# EAGLE board EK-TM4C1294XL REV D (EAGLE 6.5.0), part 1 of 2
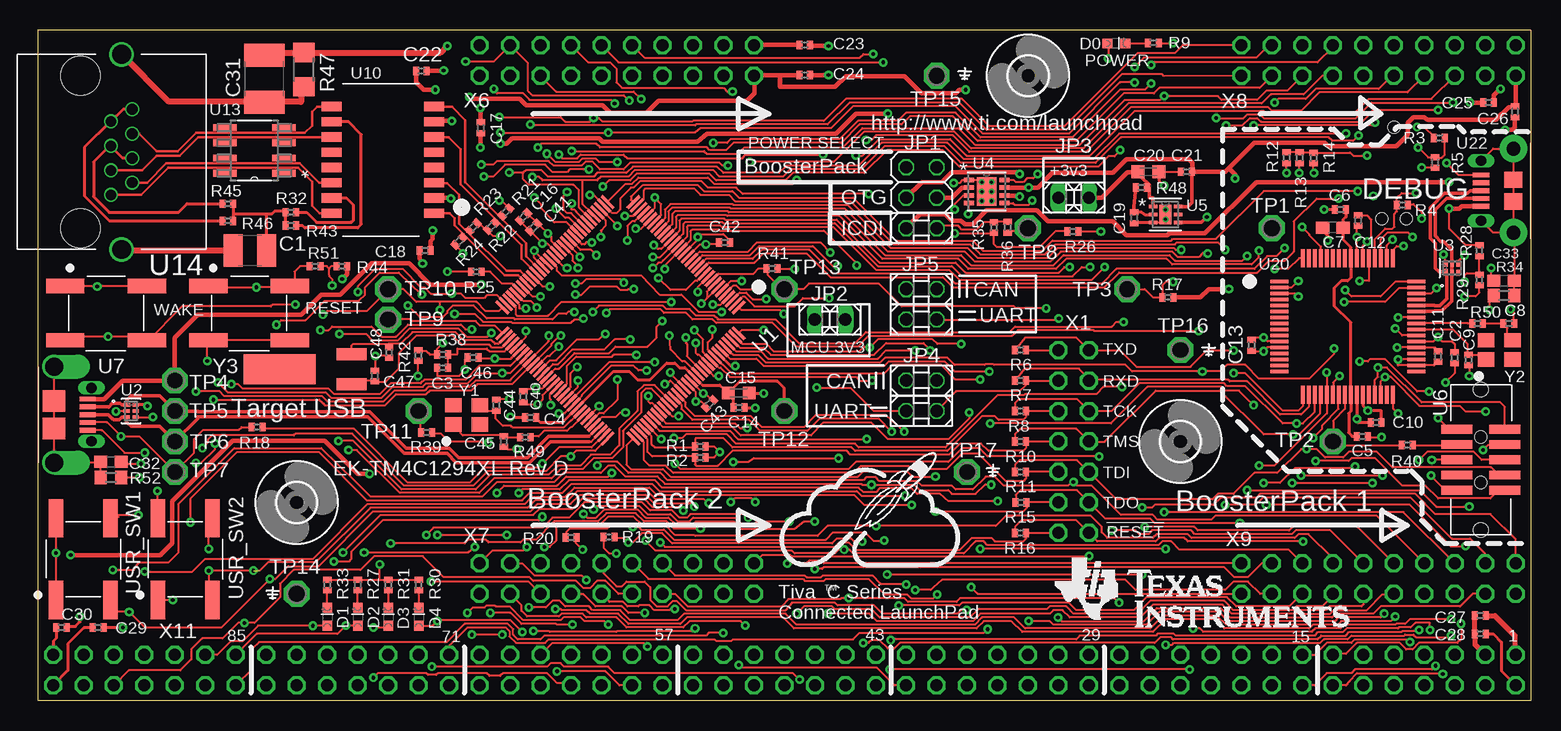
[diagram p6: board, top side]
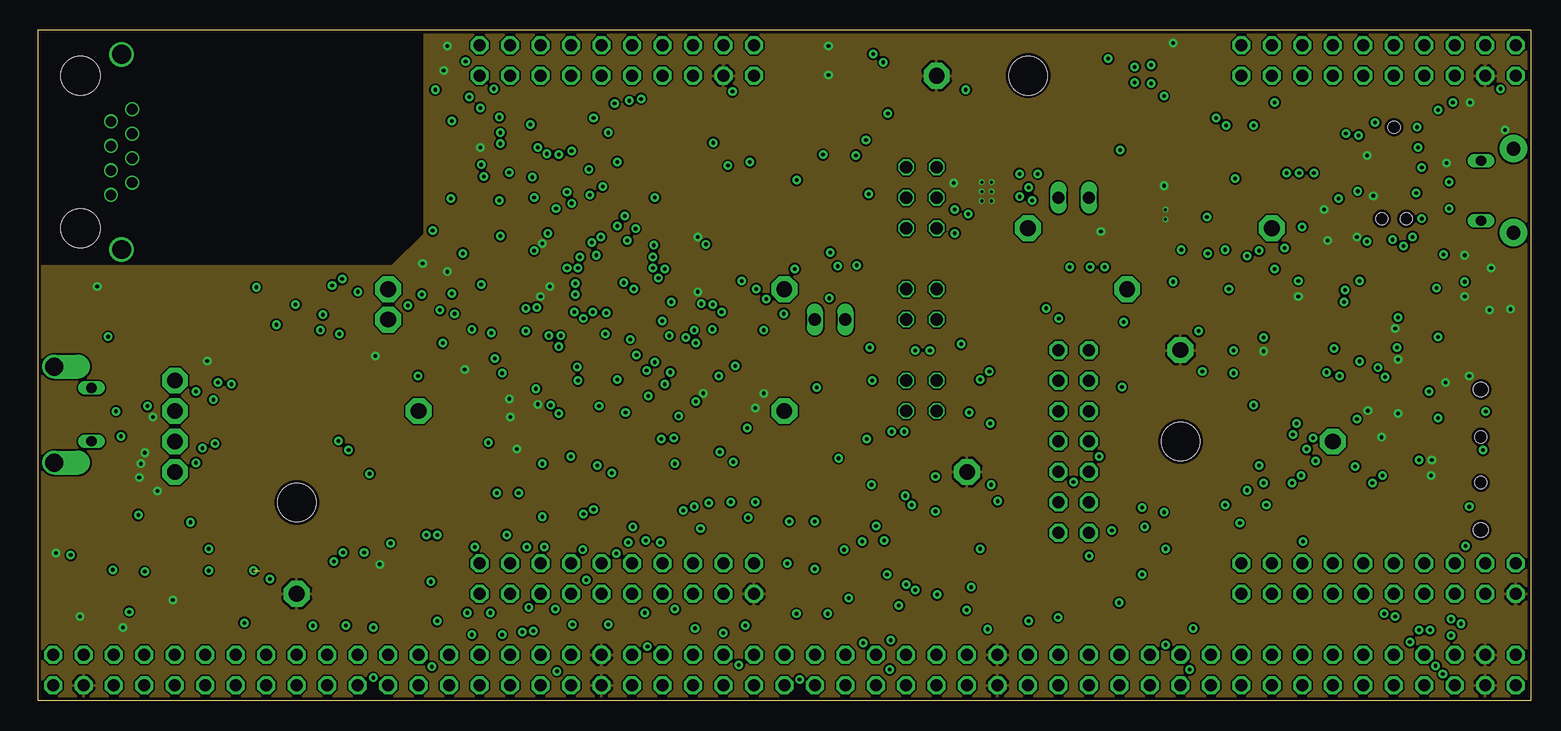
[diagram p7: board, inner layer Route2]
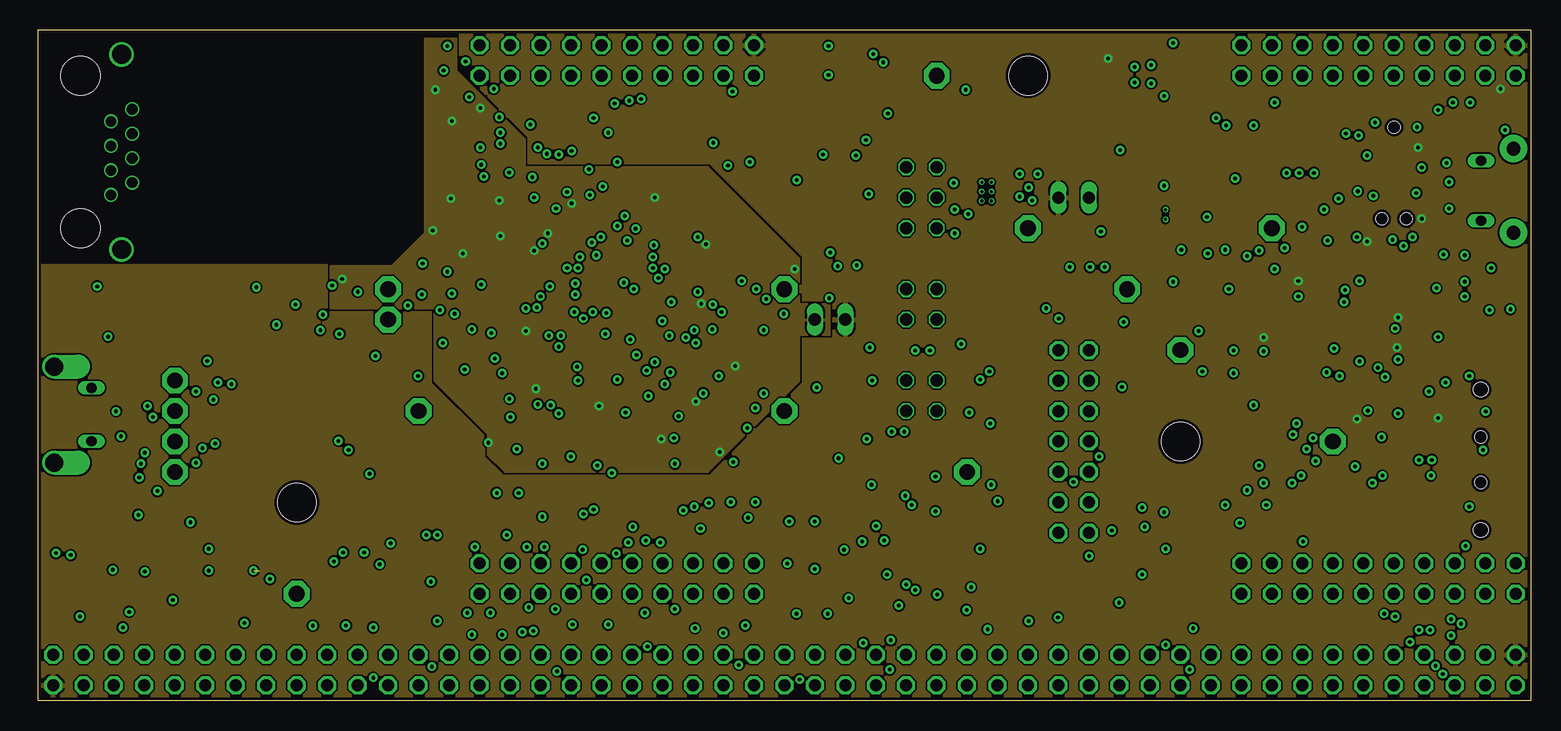
[diagram p8: board, inner layer Route15]
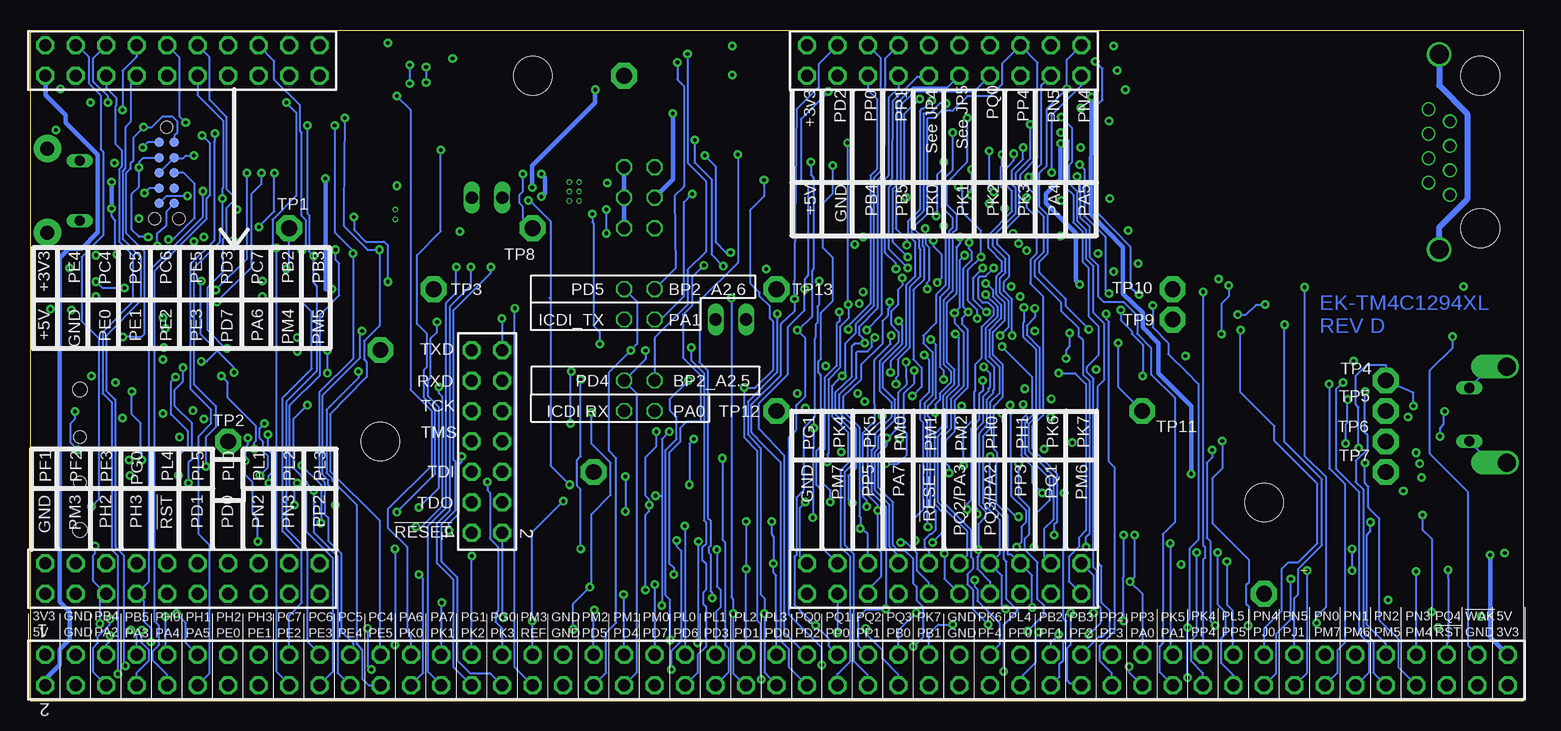
[diagram p9: board, bottom side, seen from below]

Size 124.46 x 55.88 mm. Coordinates in mm from the lower left corner, seen from the top.
Outline: 124.46,55.88 124.46,0 0,0 0,55.88 124.46,55.88
Copper layers (1+2*15+16): Top 0.035mm / dielectric 0.22mm / Route2 0.035mm / dielectric 1mm / Route15 0.035mm / dielectric 0.22mm / Bottom 0.035mm
Design rules "default *": minimum track width 6mil, minimum drill 12mil, track to track 6mil, track to pad 6mil, pad to pad 5mil, via to via 6mil, smd to smd 5mil, copper to edge 10mil, drill to drill 8mil, minimum pad ring 4mil, minimum via ring 8mil, stop-mask expansion 2mil, vias tented up to drill 13mil, thermal gap 8mil
Net classes: 1 USB: width 0.275 mm, clearance 0.152 mm; 2 Ethernet: width 0.22 mm, clearance 0.152 mm

## Footprints (pad centres in the part's own frame; a part is rotated, then mirrored left to right if it is on the bottom)
C1210 = smd 1.6 x 2.7: 1 -1.4,0; 2 1.4,0
C0402 = smd 0.5 x 0.7: 1 -0.45,0; 2 0.45,0
C0603 = smd 1.1 x 1: 1 -0.85,0; 2 0.85,0
C0603K = smd 1.05 x 1.08: 1 -0.875,0; 2 0.875,0
C1812 = smd 1.9 x 3.4: 1 -1.95,0; 2 1.95,0
CHIPLED_0603 = smd 0.8 x 0.8: A 0,-0.75; C 0,0.75
3,2 = hole 3.2: 0,0
2X03 = drill 1.016 octagon: 1 -2.54,-1.27; 2 -2.54,1.27; 3 0,-1.27; 4 0,1.27; 5 2.54,-1.27; 6 2.54,1.27
1X02 = drill 1.016 long: 1 -1.27,0; 2 1.27,0
2X02 = drill 1.016 octagon: 1 -1.27,-1.27; 2 -1.27,1.27; 3 1.27,-1.27; 4 1.27,1.27
R0402 = smd 0.5 x 0.7: 1 -0.45,0; 2 0.45,0
R0603 = smd 1 x 1.1: 1 -0.85,0; 2 0.85,0
R1206 = smd 1.6 x 1.803: 1 -1.422,0; 2 1.422,0
SWITCH_6MM_6MM_TE_CON_SMD = smd 1.2 x 3.2: P$1 4.521,6.807; P$2 4.521,0; P$3 0,6.807; P$4 0,0
P1-13 = drill 1.321 pad 2.159 octagon: TP 0,0
TQFP-128 = smd 1.45 x 0.25: P$1 0,0; P$2 0,-0.4; P$3 0,-0.8; P$4 0,-1.2; P$5 0,-1.6; P$6 0,-2; P$7 0,-2.4; P$8 0,-2.8; P$9 0,-3.2; P$10 0,-3.6; P$11 0,-4; P$12 0,-4.4; P$13 0,-4.8; P$14 0,-5.2; P$15 0,-5.6; P$16 0,-6; P$17 0,-6.4; P$18 0,-6.8; P$19 0,-7.2; P$20 0,-7.6; P$21 0,-8; P$22 0,-8.4; P$23 0,-8.8; P$24 0,-9.2; P$25 0,-9.6; P$26 0,-10; P$27 0,-10.4; P$28 0,-10.8; P$29 0,-11.2; P$30 0,-11.6; P$31 0,-12; P$32 0,-12.4; P$65 15.45,-12.4; P$66 15.45,-12; P$67 15.45,-11.6; P$68 15.45,-11.2; P$69 15.45,-10.8; P$70 15.45,-10.4; P$71 15.45,-10; P$72 15.45,-9.6; P$73 15.45,-9.2; P$74 15.45,-8.8; P$75 15.45,-8.4; P$76 15.45,-8; P$77 15.45,-7.6; P$78 15.45,-7.2; P$79 15.45,-6.8; P$80 15.45,-6.4; P$81 15.45,-6; P$82 15.45,-5.6; P$83 15.45,-5.2; P$84 15.45,-4.8; P$85 15.45,-4.4; P$86 15.45,-4; P$87 15.45,-3.6; P$88 15.45,-3.2; P$89 15.45,-2.8; P$90 15.45,-2.4; P$91 15.45,-2; P$92 15.45,-1.6; P$93 15.45,-1.2; P$94 15.45,-0.8; P$95 15.45,-0.4; P$96 15.45,0 | smd 0.25 x 1.45: P$33 1.525,-13.925; P$34 1.925,-13.925; P$35 2.325,-13.925; P$36 2.725,-13.925; P$37 3.125,-13.925; P$38 3.525,-13.925; P$39 3.925,-13.925; P$40 4.325,-13.925; P$41 4.725,-13.925; P$42 5.125,-13.925; P$43 5.525,-13.925; P$44 5.925,-13.925; P$45 6.325,-13.925; P$46 6.725,-13.925; P$47 7.125,-13.925; P$48 7.525,-13.925; P$49 7.925,-13.925; P$50 8.325,-13.925; P$51 8.725,-13.925; P$52 9.125,-13.925; P$53 9.525,-13.925; P$54 9.925,-13.925; P$55 10.325,-13.925; P$56 10.725,-13.925; P$57 11.125,-13.925; P$58 11.525,-13.925; P$59 11.925,-13.925; P$60 12.325,-13.925; P$61 12.725,-13.925; P$62 13.125,-13.925; P$63 13.525,-13.925; P$64 13.925,-13.925; P$97 13.925,1.525; P$98 13.525,1.525; P$99 13.125,1.525; P$100 12.725,1.525; P$101 12.325,1.525; P$102 11.925,1.525; P$103 11.525,1.525; P$104 11.125,1.525; P$105 10.725,1.525; P$106 10.325,1.525; P$107 9.925,1.525; P$108 9.525,1.525; P$109 9.125,1.525; P$110 8.725,1.525; P$111 8.325,1.525; P$112 7.925,1.525; P$113 7.525,1.525; P$114 7.125,1.525; P$115 6.725,1.525; P$116 6.325,1.525; P$117 5.925,1.525; P$118 5.525,1.525; P$119 5.125,1.525; P$120 4.725,1.525; P$121 4.325,1.525; P$122 3.925,1.525; P$123 3.525,1.525; P$124 3.125,1.525; P$125 2.725,1.525; P$126 2.325,1.525; P$127 1.925,1.525; P$128 1.525,1.525
DRY6 = smd 0.559 x 0.305: 1 -0.356,0.508 | smd 0.508 x 0.305: 2 -0.381,0; 3 -0.381,-0.508; 4 0.381,-0.508; 5 0.381,0; 6 0.381,0.508
DRB8_2P4X1P65 = smd 0.838 x 0.356: 1 -1.473,0.965; 2 -1.473,0.33; 3 -1.473,-0.33; 4 -1.473,-0.965; 5 1.473,-0.965; 6 1.473,-0.33; 7 1.473,0.33; 8 1.473,0.965 | smd 1.651 x 2.388: 9 0,0 | drill 0.254: V 0.406,0.787; V_2 -0.406,0; V_3 -0.406,-0.787; V_4 -0.406,0.787; V_5 0.406,-0.787; V_6 0.406,0
DRV6_1P6X1 = smd 0.711 x 0.305: 1 -1.041,0.66; 2 -1.041,0; 3 -1.041,-0.66; 4 1.041,-0.66; 5 1.041,0; 6 1.041,0.66 | smd 1.016 x 1.6: 7 0,0 | drill 0.254: V 0,-0.406; V_2 0,0.406
CON_2X5_50MIL = smd 0.74 x 2.6: P1 0,0; P2 0,4.008; P3 1.27,0; P4 1.27,4.008; P5 2.54,0; P6 2.54,4.008; P7 3.81,0; P8 3.81,4.008; P9 5.08,0; P10 5.08,4.008 | hole 1: 4.44,2; 0.64,2 | hole 1.2: 8.407,2; -3.327,2
CON_USB_MICRO_AB_HIROSE_ZX62D-AB-5P8 = smd 1.35 x 0.4: P1 2.8,1.3; P2 2.8,0.65; P3 2.8,0; P4 2.8,-0.65; P5 2.8,-1.3 | smd 1.9 x 1.8: P$1 0,-1.15; P$2 0,1.15 | drill 0.85 pad 1.092 long: P$3 3.125,2.225; P$4 3.125,-2.225 | drill 1.5 pad 2 offset: P$5 0,-4; P$6 0,4
MAG_PULSE_HX1188FNL = smd 0.76 x 1.67: P$1 0,0; P$2 1.27,0; P$3 2.54,0; P$4 3.81,0; P$5 5.08,0; P$6 6.35,0; P$7 7.62,0; P$8 8.89,0; P$9 8.89,8.55; P$10 7.62,8.55; P$11 6.35,8.55; P$12 5.08,8.55; P$13 3.81,8.55; P$14 2.54,8.55; P$15 1.27,8.55; P$16 0,8.55
D8 = smd 1.981 x 0.559: 1 -2.464,1.905; 2 -2.464,0.635; 3 -2.464,-0.635; 4 -2.464,-1.905; 5 2.464,-1.905; 6 2.464,-0.635; 7 2.464,0.635; 8 2.464,1.905
RJ45_TE_CON_NOMAG_NOLED = drill 0.89: 1 9.93,2.54; 2 8.91,4.32; 3 7.89,2.54; 4 6.87,4.32; 5 5.85,2.54; 6 4.83,4.32; 7 3.81,2.54; 8 2.79,4.32 | drill 1.57: 9 -1.78,3.43; 10 14.48,3.43 | hole 3.25: 0,0; 12.7,0
LQFP-64-PM = smd 1.5 x 0.3: P$1 0,0; P$2 0,-0.5; P$3 0,-1; P$4 0,-1.5; P$5 0,-2; P$6 0,-2.5; P$7 0,-3; P$8 0,-3.5; P$9 0,-4; P$10 0,-4.5; P$11 0,-5; P$12 0,-5.5; P$13 0,-6; P$14 0,-6.5; P$15 0,-7; P$16 0,-7.5; P$33 11.4,-7.5; P$34 11.4,-7; P$35 11.4,-6.5; P$36 11.4,-6; P$37 11.4,-5.5; P$38 11.4,-5; P$39 11.4,-4.5; P$40 11.4,-4; P$41 11.4,-3.5; P$42 11.4,-3; P$43 11.4,-2.5; P$44 11.4,-2; P$45 11.4,-1.5; P$46 11.4,-1; P$47 11.4,-0.5; P$48 11.4,0 | smd 0.3 x 1.5: P$17 1.95,-9.45; P$18 2.45,-9.45; P$19 2.95,-9.45; P$20 3.45,-9.45; P$21 3.95,-9.45; P$22 4.45,-9.45; P$23 4.95,-9.45; P$24 5.45,-9.45; P$25 5.95,-9.45; P$26 6.45,-9.45; P$27 6.95,-9.45; P$28 7.45,-9.45; P$29 7.95,-9.45; P$30 8.45,-9.45; P$31 8.95,-9.45; P$32 9.45,-9.45; P$49 9.45,1.95; P$50 8.95,1.95; P$51 8.45,1.95; P$52 7.95,1.95; P$53 7.45,1.95; P$54 6.95,1.95; P$55 6.45,1.95; P$56 5.95,1.95; P$57 5.45,1.95; P$58 4.95,1.95; P$59 4.45,1.95; P$60 3.95,1.95; P$61 3.45,1.95; P$62 2.95,1.95; P$63 2.45,1.95; P$64 1.95,1.95
TC2030-MCP-NL = smd 0.787 x 0.787: 1 1.27,-0.635; 2 2.54,-0.635; 3 3.81,-0.635; 4 5.08,-0.635; 5 6.35,-0.635; 6 6.35,0.635; 7 5.08,0.635; 8 3.81,0.635; 9 2.54,0.635; 10 1.27,0.635 | hole 1: 0,0; 7.62,-1.016; 7.62,1.016
CON_USB_MICRO_B_FCI_10118194 = smd 1.35 x 0.4: P1 2.7,1.3; P2 2.7,0.65; P3 2.7,0; P4 2.7,-0.65; P5 2.7,-1.3 | smd 1.5 x 1.35: P6 0,0.9; P7 0,-0.9 | drill 0.85 long: P8 2.7,2.5; P9 2.7,-2.5 | drill 1.15 pad 2.286: P10 0,-3.5; P11 0,3.5
TSW-107-02-S-D = drill 1 pad 1.5 octagon: 1 7.62,-1.27; 2 7.62,1.27; 3 5.08,-1.27; 4 5.08,1.27; 5 2.54,-1.27; 6 2.54,1.27; 7 0,-1.27; 8 0,1.27; 9 -2.54,-1.27; 10 -2.54,1.27; 11 -5.08,-1.27; 12 -5.08,1.27; 13 -7.62,-1.27; 14 -7.62,1.27
TSW-110-02-S-D = drill 1 pad 1.5 octagon: 1 11.43,-1.27; 2 11.43,1.27; 3 8.89,-1.27; 4 8.89,1.27; 5 6.35,-1.27; 6 6.35,1.27; 7 3.81,-1.27; 8 3.81,1.27; 9 1.27,-1.27; 10 1.27,1.27; 11 -1.27,-1.27; 12 -1.27,1.27; 13 -3.81,-1.27; 14 -3.81,1.27; 15 -6.35,-1.27; 16 -6.35,1.27; 17 -8.89,-1.27; 18 -8.89,1.27; 19 -11.43,-1.27; 20 -11.43,1.27
TSW-149-02-S-D = drill 1 pad 1.5 octagon: 1 60.96,-1.27; 2 60.96,1.27; 3 58.42,-1.27; 4 58.42,1.27; 5 55.88,-1.27; 6 55.88,1.27; 7 53.34,-1.27; 8 53.34,1.27; 9 50.8,-1.27; 10 50.8,1.27; 11 48.26,-1.27; 12 48.26,1.27; 13 45.72,-1.27; 14 45.72,1.27; 15 43.18,-1.27; 16 43.18,1.27; 17 40.64,-1.27; 18 40.64,1.27; 19 38.1,-1.27; 20 38.1,1.27; 21 35.56,-1.27; 22 35.56,1.27; 23 33.02,-1.27; 24 33.02,1.27; 25 30.48,-1.27; 26 30.48,1.27; 27 27.94,-1.27; 28 27.94,1.27; 29 25.4,-1.27; 30 25.4,1.27; 31 22.86,-1.27; 32 22.86,1.27; 33 20.32,-1.27; 34 20.32,1.27; 35 17.78,-1.27; 36 17.78,1.27; 37 15.24,-1.27; 38 15.24,1.27; 39 12.7,-1.27; 40 12.7,1.27; 41 10.16,-1.27; 42 10.16,1.27; 43 7.62,-1.27; 44 7.62,1.27; 45 5.08,-1.27; 46 5.08,1.27; 47 2.54,-1.27; 48 2.54,1.27; 49 0,-1.27; 50 0,1.27; 51 -2.54,-1.27; 52 -2.54,1.27; 53 -5.08,-1.27; 54 -5.08,1.27; 55 -7.62,-1.27; 56 -7.62,1.27; 57 -10.16,-1.27; 58 -10.16,1.27; 59 -12.7,-1.27; 60 -12.7,1.27; 61 -15.24,-1.27; 62 -15.24,1.27; 63 -17.78,-1.27; 64 -17.78,1.27; 65 -20.32,-1.27; 66 -20.32,1.27; 67 -22.86,-1.27; 68 -22.86,1.27; 69 -25.4,-1.27; 70 -25.4,1.27; 71 -27.94,-1.27; 72 -27.94,1.27; 73 -30.48,-1.27; 74 -30.48,1.27; 75 -33.02,-1.27; 76 -33.02,1.27; 77 -35.56,-1.27; 78 -35.56,1.27; 79 -38.1,-1.27; 80 -38.1,1.27; 81 -40.64,-1.27; 82 -40.64,1.27; 83 -43.18,-1.27; 84 -43.18,1.27; 85 -45.72,-1.27; 86 -45.72,1.27; 87 -48.26,-1.27; 88 -48.26,1.27; 89 -50.8,-1.27; 90 -50.8,1.27; 91 -53.34,-1.27; 92 -53.34,1.27; 93 -55.88,-1.27; 94 -55.88,1.27; 95 -58.42,-1.27; 96 -58.42,1.27; 97 -60.96,-1.27; 98 -60.96,1.27
NDK3.2X2.5 = smd 1.4 x 1.2: P$1 0,0; P$2 2.2,0; P$3 2.2,1.6; P$4 0,1.6
CRYSTAL_32K_SMD = smd 2.5 x 1: P$1 0,1.25; P$2 0,-1.25 | smd 6 x 2.5: P$3 -6,0

## Placement (x,y rotation side)
C1  1000pF  [C1210]  17.68,37.49 180 top
C2  0.1uF  [C0402]  118.11,28.57 270 top
C3  0.1uF  [C0402]  33.76,27.74 180 top
C4  0.1uF  [C0402]  41.07,23.6 180 top
C5  0.1uF  [C0402]  110.41,22 0 top
C6  1.0uF  [C0402]  108.58,40.92 180 top
C7  2.2uF  [C0603]  107.95,39.42 180 top
C8  12pF  [C0402]  122.63,31.42 0 top
C9  12pF  [C0402]  119.25,28.37 270 top
C10  0.1uF  [C0402]  111.56,23.16 0 top
C11  0.1uF  [C0402]  116.71,28.68 270 top
C12  0.1uF  [C0402]  110.06,40.01 270 top
C13  0.1uF  [C0402]  101.17,29.62 270 top
C14  1.0uF  [C0402]  58.45,24.41 0 top
C15  2.2uF  [C0603K]  58.45,25.63 0 top
C16  0.1uF  [C0402]  40.49,40.31 225 top
C17  0.1uF  [C0402]  36.93,47.73 270 top
C18  0.1uF  [C0402]  32.28,37.49 180 top
C19  0.1uF  [C0402]  91.39,40.23 270 top
C20  2.2uF  [C0603K]  92.58,44.07 0 top
C21  0.1uF  [C0402]  95.76,44.07 180 top
C22  0.1uF  [C0402]  31.98,52.48 0 top
C23  0.1uF  [C0402]  63.93,54.64 0 top
C24  0.1uF  [C0402]  63.93,52.12 0 top
C25  0.1uF  [C0402]  120.93,49.83 180 top
C26  0.1uF  [C0402]  123.14,49.07 270 top
C27  0.1uF  [C0402]  120.24,7.09 180 top
C28  0.1uF  [C0402]  120.24,5.56 180 top
C29  0.1uF  [C0402]  5.03,6.1 0 top
C30  0.1uF  [C0402]  1.98,6.1 0 top
C31  4700pF  [C1812]  18.9,51.82 90 top
C32  3300pF  [C0603]  6.1,19.89 0 top
C33  3300pF  [C0603]  122.22,34.98 180 top
C40  0.1uF  [C0402]  40.46,25.32 270 top
C41  0.1uF  [C0402]  41.33,39.45 225 top
C42  0.1uF  [C0402]  57.25,38.18 0 top
C43  0.1uF  [C0402]  56.01,24.74 45 top
C44  12pF  [C0402]  38.23,24.61 90 top
C45  12pF  [C0402]  38.84,21.59 270 top
C46  0.1uF  [C0402]  36.3,28.6 180 top
C47  12pF  [C0402]  28.09,27.05 90 top
C48  12pF  [C0402]  29.29,29.01 270 top
D0  [CHIPLED_0603]  89.92,54.76 270 top
D1  [CHIPLED_0603]  24.13,6.99 0 top
D2  [CHIPLED_0603]  26.67,6.99 0 top
D3  [CHIPLED_0603]  29.21,6.99 0 top
D4  [CHIPLED_0603]  31.75,6.99 0 top
H1  MOUNT-HOLE3.2  [3,2]  95.25,21.59 0 top
H4  MOUNT-HOLE3.2  [3,2]  21.59,16.51 0 top
H6  MOUNT-HOLE3.2  [3,2]  82.55,52.07 0 top
J1  [JUMP]  73.66,39.37 90 top
J2  [JUMP]  73.66,24.13 90 top
J3  [JUMP]  86.36,41.91 90 top
J4  [JUMP]  73.66,26.67 90 top
J5  [JUMP]  73.66,31.75 90 top
J6  [JUMP]  73.66,34.29 90 top
J7  [JUMP]  66.04,31.75 90 top
JP1  [2X03]  73.66,41.91 270 top
JP2  [1X02]  66.04,31.75 180 top
JP3  [1X02]  86.36,41.91 0 top
JP4  [2X02]  73.66,25.4 90 top
JP5  [2X02]  73.66,33.02 90 top
R1  10k  [R0402]  55.22,21.18 180 top
R2  10k  [R0402]  55.22,20.24 180 top
R3  10k  [R0402]  116.84,46.89 0 top
R4  10k  [R0402]  113.74,41.3 180 top
R5  10k  [R0402]  116.48,44.83 270 top
R6  0  [R0402]  81.92,29.21 180 top
R7  0  [R0402]  81.92,26.67 180 top
R8  0  [R0402]  81.92,24.13 180 top
R9  330  [R0402]  92.99,54.81 180 top
R10  0  [R0402]  81.92,21.59 180 top
R11  0  [R0402]  81.92,19.05 180 top
R12  5.6k  [R0402]  104.09,45.24 90 top
R13  5.6k  [R0402]  105.18,45.24 90 top
R14  5.6k  [R0402]  106.35,45.21 90 top
R15  0  [R0402]  81.97,16.51 180 top
R16  0  [R0402]  81.92,13.97 180 top
R17  100k  [R0402]  94.21,33.6 180 top
R18  100  [R0402]  18.29,22.78 180 top
R19  0  [R0402]  47.62,13.61 0 top
R20  0  [R0402]  44.45,13.59 180 top
R21  49.9  [R0402]  39.01,40.72 225 top
R22  49.9  [R0402]  37.82,39.52 45 top
R23  49.4  [R0402]  36.3,39.47 225 top
R24  49.9  [R0402]  35.1,38.28 45 top
R25  4.87k 1%  [R0402]  36.55,35.74 180 top
R26  100k  [R0402]  86.28,39.09 0 top
R27  330  [R0402]  26.67,9.63 270 top
R28  5.6k  [R0402]  120.17,37.49 90 top
R29  10k  [R0402]  120.17,35.05 90 top
R30  330  [R0402]  31.75,9.63 270 top
R31  330  [R0402]  29.21,9.63 270 top
R32  75  [R0402]  21.11,40.69 0 top
R33  330  [R0402]  24.13,9.63 270 top
R34  1M  [R0603]  122.22,33.76 0 top
R35  10k  [R0402]  79.71,39.42 270 top
R36  100k  [R0402]  80.85,39.45 90 top
R38  51  [R0402]  33.76,28.83 0 top
R39  0  [R0402]  32.41,22.33 0 top
R40  0  [R0402]  114.17,21.29 0 top
R41  0  [R0402]  61.21,36.02 0 top
R42  1M  [R0402]  31.72,28.75 270 top
R43  75  [R0402]  21.11,39.57 0 top
R44  10k  [R0402]  25.35,36.2 180 top
R45  75  [R0402]  15.85,41.4 180 top
R46  75  [R0402]  15.85,39.98 180 top
R47  1M  [R1206]  22.17,52.58 270 top
R48  [R0402]  92,42.76 0 top
R49  2k  [R0402]  40.64,21.95 0 top
R50  2k  [R0402]  120.02,31.42 0 top
R51  100  [R0402]  23.13,36.2 0 top
R52  1M  [R0603]  6.1,18.59 180 top
RESET  SWITCH_TACTILE  [SWITCH_6MM_6MM_TE_CON_SMD]  14.22,34.54 270 top
TP1  TPPAD1-13  [P1-13]  102.87,39.37 270 top
TP2  TPPAD1-13  [P1-13]  107.95,21.59 0 top
TP3  TPPAD1-13  [P1-13]  90.81,34.29 180 top
TP4  TPPAD1-13  [P1-13]  11.43,26.67 90 top
TP5  TPPAD1-13  [P1-13]  11.43,24.13 270 top
TP6  TPPAD1-13  [P1-13]  11.43,21.59 90 top
TP7  TPPAD1-13  [P1-13]  11.43,19.05 270 top
TP8  TPPAD1-13  [P1-13]  82.55,39.37 180 top
TP9  TPPAD1-13  [P1-13]  29.21,31.75 0 top
TP10  TPPAD1-13  [P1-13]  29.21,34.29 0 top
TP11  TPPAD1-13  [P1-13]  31.75,24.13 0 top
TP12  TPPAD1-13  [P1-13]  62.23,24.13 0 top
TP13  TPPAD1-13  [P1-13]  62.23,34.29 0 top
TP14  TPPAD1-13  [P1-13]  21.59,8.89 0 top
TP15  TPPAD1-13  [P1-13]  74.93,52.07 0 top
TP16  TPPAD1-13  [P1-13]  95.25,29.21 0 top
TP17  TPPAD1-13  [P1-13]  77.47,19.05 0 top
U1  TM4C1294NCPDT  [TQFP-128]  58.42,32.77 225 top
U2  TPD4S012_DRY_6  [DRY6]  7.77,24.13 0 top
U3  TPD4S012_DRY_6  [DRY6]  117.88,36.04 90 top
U4  TPS2052B_DRB_8  [DRB8_2P4X1P65]  79.1,42.42 0 top
U5  TPS73733_DRV_6  [DRV6_1P6X1]  94,40.5 0 top
U6  JTAG_ARM_10PIN  [CON_2X5_50MIL]  118.29,22.61 270 top
U7  CON_USB_HIROSE_MICRO_AB_ZX62D_AB_5P8  [CON_USB_MICRO_AB_HIROSE_ZX62D-AB-5P8]  1.35,23.83 0 top
U10  MAG_PULSE_HX1188FNL  [MAG_PULSE_HX1188FNL]  33.05,40.61 90 top
U13  SLVU2.8-4  [D8]  18.06,45.85 180 top
U14  JACK_RJ45_NOMAG_NOLED_TECON  [RJ45_TE_CON_NOMAG_NOLED]  3.56,52.07 270 top
U20  TM4C123GH6PMI  [LQFP-64-PM]  103.5,34.92 0 top
U21  TC2050-NL-MCP-NL  [TC2030-MCP-NL]  113.06,47.78 270 bottom
U22  CON_USB_FCI_MICRO_B_10118194  [CON_USB_MICRO_B_FCI_10118194]  123.01,42.49 180 top
USR_SW1  SWITCH_TACTILE  [SWITCH_6MM_6MM_TE_CON_SMD]  1.52,8.38 0 top
USR_SW2  SWITCH_TACTILE  [SWITCH_6MM_6MM_TE_CON_SMD]  10.03,8.38 0 top
WAKE  SWITCH_TACTILE  [SWITCH_6MM_6MM_TE_CON_SMD]  2.29,34.54 270 top
X1  TSW-107-02-S-D  [TSW-107-02-S-D]  86.36,21.59 270 bottom
X6  TSW-110-02-S-D  [TSW-110-02-S-D]  48.26,53.34 180 bottom
X7  TSW-110-02-S-D  [TSW-110-02-S-D]  48.26,10.16 180 bottom
X8  TSW-110-02-S-D  [TSW-110-02-S-D]  111.76,53.34 180 bottom
X9  TSW-110-02-S-D  [TSW-110-02-S-D]  111.76,10.16 180 bottom
X11  TSW-149-02-S-D  [TSW-149-02-S-D]  62.23,2.54 180 bottom
Y1  25Mhz  [NDK3.2X2.5]  34.65,23.01 0 top
Y2  16M  [NDK3.2X2.5]  120.73,28.42 0 top
Y3  CRYATL_32K_SMD  [CRYSTAL_32K_SMD]  26.16,27.61 0 top

## Tracks (layer width: path | path; a pad name or v marks a point on that pad's centre or on a via)
!DEBUG_RESET_OUT  (via drill 0.3)
  Top 0.152: U20.P$23 108.43,25.45 108.43,24.31 107.06,22.94 107.06,22.63 v106.3,21.87 | R16.2 81.46,13.95 81.46,14.48 81.49,14.51 81.99,15.01 86.59,15.01 X1.1 87.61,13.97 88.32,13.26 93.19,13.26 93.5,13.56 95.56,13.56 95.86,13.26 v105.46,13.26 | U6.P10 121.77,17.53 121.08,16.84 116.74,16.84 115.67,17.91 113.77,17.91 111.48,20.19 109.5,20.19 109.27,19.96 v106.53,19.96
  Bottom 0.152: v105.46,13.26 105.46,15.16 105.92,15.62 105.92,18.21 106.53,18.82 v106.53,19.96 106.53,21.11 106.3,21.34 v106.3,21.87
!EXTERNAL_DEBUG
  Top 0.152: U20.P$24 108.95,24.3 107.97,23.32 107.97,21.61 | 107.97,21.61 TP2.TP | 107.97,21.61 108.33,21.26 113.5,21.26 R40.1
!HIB
  Top 0.152: TP9.TP 29.34,31.77 31.01,31.77 31.17,31.62 36.5,31.62 36.88,31.24 38.1,31.24 38.12,31.22 U1.P$65
!TARGET_RESET  (via drill 0.3)
  Top 0.152: RESET.P$4 15.54,34.52 15.24,34.52 15.32,34.44 v18.21,34.44 | v18.21,34.44 18.25,34.48 19.62,34.48 20.01,34.78 | 20.01,34.78 RESET.P$3 | v51.89,13.18 52.27,12.8 66.45,12.8 66.83,13.18 67.59,13.18 68.2,12.57 76.89,12.57 77.88,13.56 79.48,13.56 79.78,13.26 82.14,13.26 82.37,13.49 82.37,13.79 R16.1 X1.2 | v85.04,6.93 85.34,6.63 92.2,6.63 93.27,7.7 98.6,7.7 99.36,6.93 105.31,6.93 105.61,7.24 107.75,7.24 108.05,7.54 110.8,7.54 112.09,8.84 112.98,8.84 X9.10 | X7.10 48.41,8.89 47.32,9.98 46.63,9.98 46.02,9.37 45.49,9.37 44.88,9.98 41.3,9.98 41,10.29 33.83,10.29 32.08,12.04 28.04,12.04 26.9,10.9 21.34,10.9 20.19,9.75 20.19,8.61 18.06,6.48 v17.22,6.48 16.69,6.48 15.39,5.18 13.72,5.18 12.8,4.27 12.8,3.43 11.89,2.52 7.59,2.52 X11.94 | v18.22,34.44 v18.21,34.44 | R51.1 21.87,36.2 21.41,35.74 21.41,34.98 21.38,34.86 21.38,34.4 21.79,34.82 20.01,34.78
  Bottom 0.152: v51.89,13.18 51.44,13.18 50.52,12.27 50.52,10.82 49.53,9.83 X7.10 | X1.2 85.09,6.99 v85.04,6.93 | v18.21,34.44 18.21,20.42 16.46,18.67 16.46,7.77 17.22,7.01 v17.22,6.48
!TARGET_RESET_FILTERED  (via drill 0.3)
  Top 0.152: 39.55,28.6 | C46.1 36.88,28.5 v38.1,28.5 39.45,28.5 39.55,28.6 | R44.2 24.46,36.2 24.31,36.04 24.31,35.97 | v24.54,34.59 24.54,35.13 24.31,35.36 24.31,35.42 24.31,35.97 | v25.15,30.56 27.36,30.56 27.89,30.02 30.02,30.02 31.01,31.01 35.05,31.01 35.74,30.33 37.49,30.33 v37.8,30.63 | 24.31,35.97 24.08,36.2 23.77,36.2 23.79,36.19 R51.2 | U1.P$70 39.55,28.6
  Bottom 0.152: v24.54,34.59 24.54,33.68 25.15,33.07 v25.15,30.56 | v37.8,30.63 37.8,29.52 38.1,29.21 v38.1,28.5
!WAKE  (via drill 0.3)
  Top 0.152: WAKE.P$2 2.9,30.33 4.88,30.32 v5.87,30.32 8.38,30.32 8.84,29.79 WAKE.P$1 9.02,30.28 9.07,29.87 12.04,32.84 19.43,32.84 19.58,32.99 v21.49,32.99 | 33.53,33.22 36.58,33.22 37.34,32.46 38.42,32.46 U1.P$64 | 33.53,33.22 31.55,33.22 30.48,34.29 TP10.TP 29.21,34.24 27.43,32.46 24.08,32.46 v23.77,32.16 | v33.53,32.54 33.53,33.22 | v31.7,27.05 31.73,27.08 R42.2
  Bottom 0.152: X11.95 4.57,4.57 4.57,17.37 7.77,20.57 7.77,27.51 5.87,29.41 v5.87,30.32 | v23.77,32.16 23.09,32.16 22.25,32.99 v21.49,32.99 | v33.53,32.54 33.53,31.7 32.61,30.79 32.61,30.56 31.7,29.64 v31.7,27.05
+3V3  (via drill 0.3)
  Top 0.152: D0.A 89.23,54.76 v89.23,53.49 | U20.P$42 114.53,31.93 v113.39,31.93 | U20.P$54 110.45,37.91 v110.8,38.25 111.18,38.63 111.18,40.08 110.87,40.39 110.19,40.39 110.19,40.31 110.22,40.43 C12.1 | v115.06,46.1 115.9,45.26 116.51,45.26 R5.1 116.5,45.25 117.03,45.25 117.27,45.49 117.27,46.79 117.2,46.86 R3.2 | v115.37,40.16 115.37,40.69 114.68,41.38 114.3,41.38 114.27,41.38 R4.1 | U20.P$2 104.53,34.42 v105.08,34.98 | 116.48,29.18 C11.1 116.42,29.43 U20.P$37 113.31,29.43 v113.31,29.41 | U20.P$11 102.51,29.93 v102.18,30.25 102.17,30.27 101.51,30.27 101.35,30.1 C13.1 | U6.P1 117.68,22.61 v116.74,23.55
  Top 0.254: C29.1 4.38,6.06 3.85,6.06 2.52,4.72 2.52,2.52 X11.98 | U20.P$26 109.95,23.85 v109.96,23.47 109.96,23.24 110.03,23.16 C10.1
  Top 0.381: C23.1 59.72,54.63 X6.1 | C25.1 121.38,50.44 v121.92,50.98
  Top 0.406: C27.1 121.46,7.09 123.14,5.41 123.14,3.81 123.11,3.95 X11.1
  Bottom 0.152: U21.1 114.66,46.51 v115.06,46.1 | v105.08,34.98 105,34.9 | v113.31,29.41 113.39,29.41 | v116.74,23.55 116.74,23.47
  Bottom 0.381: v121.92,50.98 121.92,51.05
  pour Route15 (rank 2): 32.26,55.88 124.46,55.88 124.46,0 0,0 0,36.2 29.51,36.2 32.26,38.91
+5V  (via drill 0.3)
  Top 0.254: C30.1 1.53,5.19 1.29,4.95 1.29,3.96 1.22,3.89 1.33,3.87 X11.97 | X11.2 122,2.46 122,4.88 121.31,5.56 C28.1
  Top 0.305: U5.6 95.88,41.16 95.86,41.15 96.21,41.5 C21.1
  Top 0.356: U4.7 v82.6,42.75
  Top 0.381: 123.17,52.07 X8.2 123.19,49.77 C26.1 122.87,49.45 122.61,49.45 121.54,48.39 115.82,48.39 115.59,48.62 114.68,48.62 114.22,48.16 114.22,47.17 113.23,46.18 107.59,46.18 107.29,46.48 101.42,46.48 99.29,44.35 | 99.29,44.35 99.01,44.07 C21.1 96.24,44.12 96.24,44.81 95.94,45.11 90.75,45.11 89.61,43.97 84.58,43.97 83.36,42.75 v82.6,42.75 | R17.1 96.93,33.6 97.61,34.29 v99.29,34.29 | v99.82,43.51 99.82,43.81 99.29,44.35 | v77.34,50.9 76.81,50.9 76.53,50.62 73.66,50.62 72.24,52.05 67.36,52.05 66.45,51.13 61.87,51.13 61.87,52.12 | v2.74,12.12 10.21,12.12 11.2,13.11 11.2,16.61 16.23,21.64 23.93,21.64 26.67,18.9 v27.66,18.9 | v35.97,50.29 36.12,50.14 40.16,50.14 40.69,49.61 47.09,49.61 47.7,49 50.75,49 51.74,49.99 59.13,49.99 59.74,50.6 59.74,52.02 X6.2 59.74,52.12 61.87,52.12 | C24.1 61.87,52.12
  Bottom 0.381: v99.29,34.29 99.82,34.29 v99.82,43.51 | v77.34,50.9 77.34,49.84 82.6,44.58 v82.6,42.75 | X11.97 2.74,5.28 v2.74,12.12 | v35.97,50.29 36.04,40.54 33.38,37.8 33.38,33.91 31.7,32.31 31.7,31.09 30.4,29.79 30.4,27.28 27.66,24.54 v27.66,18.9 | X11.2 123.19,1.78 122,2.97 122,4.27 121.16,5.11 121.16,7.39 122,8.23 122,36.88 121.23,37.64 120.17,37.64 118.8,39.01 118.8,45.49 121.46,48.16 121.46,48.77 123.14,50.44 123.14,52.02 X8.2
BP2_A2.5  (via drill 0.3)
  Top 0.152: X6.9 50.57,53.57 68.5,53.57 68.81,53.87 v69.65,53.87
  Bottom 0.152: v69.65,53.87 69.65,44.81 68.12,43.28 68.12,37.41 69.65,35.89 69.65,32.99 72.39,30.25 JP4.4
BP2_A2.6  (via drill 0.3)
  Top 0.152: X6.11 48.41,53.19 v70.48,53.19
  Bottom 0.152: v70.48,53.19 70.48,51.74 69.95,51.21 69.95,42.82 70.71,42.06 70.64,36.04 JP5.4
CHASSIS
  Top 0.508: C1.2 7.09,37.49 U14.10 | U14.9 10.93,49.91 17.91,49.91 C31.1 20.06,49.89 21.95,49.89 21.95,50.83 22.1,50.83 | R47.2 21.84,51.05 22.1,50.8 22.1,50.83 | 22.1,51.05 22.1,50.83
  Bottom 0.508: U14.9 6.99,51.26 4.65,48.92 4.65,41.76 7.01,39.4 7.01,37.61 U14.10
DEBUG_ACTIVE  (via drill 0.3)
  Top 0.152: v103.1,35.97 104.24,35.97 105.15,36.88 U20.P$64
  Bottom 0.152: v103.1,35.97 102.87,36.2 TP1.TP
DEBUG_PC0/TCK/SWCLK  (via drill 0.3)
  Top 0.152: U20.P$19 106.45,24.08 105.46,23.09 v104.93,23.09 103.78,23.09 100.66,26.21 99.14,26.21 98.91,26.44 91.82,26.44 89.51,24.13 X1.9 86.61,25.15 81.84,25.15 81.49,24.8 81.49,24.19 81.38,24.08 | R8.2 81.38,24.08 | 81.38,24 81.38,24.08 | v112.09,18.75 v105.31,18.75 | U20.P$30 111.95,26.61 v112.32,26.98 112.78,26.98 115.21,24.54 118.57,24.54 119.02,24.08 v120.7,24.08 | U6.P4 121.84,21.34 121.69,21.26 120.85,21.26 v120.47,20.88
  Bottom 0.152: v105.31,18.75 104.62,19.43 104.62,20.34 105,20.73 105,21.57 105.31,21.87 105.31,22.63 v104.93,23.09 | v112.09,18.75 112.09,20.42 111.33,21.11 111.33,22.48 112.7,23.85 112.7,26.59 v112.32,26.98 | v120.47,20.88 121.08,21.49 121.08,23.09 120.7,23.47 v120.7,24.08
DEBUG_PC1/TMS/SWDIO  (via drill 0.3)
  Top 0.152: U20.P$20 106.91,25.43 106.91,23.93 105.16,22.17 v104.62,22.17 102.18,22.17 98.53,25.83 93.19,25.83 88.92,21.57 87.94,21.57 87.86,21.64 X1.7 87.61,21.59 86.56,22.63 81.92,22.63 81.46,22.17 81.46,21.79 81.53,21.72 R10.2 | v104.55,18.14 v111.25,18.14 | U20.P$29 111.45,26.72 111.71,26.98 v111.71,27.74 112.47,27.74 115.37,24.84 121.92,24.84 122.3,24.46 U6.P2
  Bottom 0.152: v104.55,18.14 104.55,18.75 104.24,19.05 104.24,20.5 104.62,20.88 v104.62,22.17 | v111.25,18.14 111.25,19.81 110.95,20.12 110.95,23.09 112.39,24.54 112.39,25.91 111.71,26.59 v111.71,27.74
DEBUG_PC2/TDI  (via drill 0.3)
  Top 0.152: X1.5 87.63,19.13 | 107.9,25.42 U20.P$22 107.97,25.5 107.97,26.52 v108.51,27.05 | X1.5 86.64,20.04 82.26,20.04 81.84,20.04 81.46,19.66 81.46,19.13 R11.2 | X1.5 89.92,16.76 97.92,16.76 98.37,17.22 99.67,17.22 101.42,18.97 103.33,18.97 105.31,20.95 v105.77,20.95 106.6,20.95 107.29,20.27 108.81,20.27 109.27,20.73 111.63,20.73 112.93,19.43 121.16,19.43 121.79,18.8 U6.P8
  Bottom 0.152: v108.51,27.05 107.97,26.52 107.97,25.22 105.61,22.86 105.61,21.64 105.77,21.49 v105.77,20.95
DEBUG_PC3/TDO/SWO  (via drill 0.3)
  Top 0.152: X1.3 87.76,16.51 | X1.3 87.63,16.54 86.64,17.53 81.92,17.53 81.53,17.14 81.53,16.61 R15.2 | 88.06,16.46 X1.3 | 87.94,16.46 87.88,16.51 X1.3 | v101.8,19.58 103.1,19.58 107.45,23.94 U20.P$21 107.44,25.49 v107.44,27.36 | v100.2,14.78 93.12,14.78 92.73,15.16 88.98,15.16 X1.3 | U20.P$53 110.95,34.98 v110.19,34.98 | v115.98,25.76 114.99,25.76 112.32,28.42 111.02,28.42 110.87,28.27 v110.19,28.27 | U6.P6 120.37,20.07 119.71,20.73 115.82,20.73 v115.14,20.04
  Bottom 0.152: v101.8,19.58 100.2,17.98 v100.2,14.78 | v110.19,34.98 110.26,34.9 110.26,30.56 108.85,29.15 | 108.85,29.15 107.52,27.81 107.52,27.43 v107.44,27.36 | v110.19,28.27 109.73,28.27 108.85,29.15 | v115.14,20.04 115.14,20.65 115.21,20.73 115.21,23.09 115.98,23.85 v115.98,25.76
DEBUG_VBUS  (via drill 0.3)
  Top 0.152: U3.6 117.35,36.42 117.35,37.11 v117.2,37.19 | R28.2 120.13,38.1 120.02,37.95 119.02,37.95 117.65,39.32 v117.65,41
  Top 0.381: JP1.5 72.39,39.4 73.53,40.54 75.67,40.54 76.2,40.01 76.96,40.01 77.27,39.7 77.95,39.7 79.1,40.84 83.29,40.84 84.2,39.93 89.61,39.93 90.75,38.79 94.18,38.79 94.34,38.94 97.31,38.94 101.58,43.2 v117.65,43.2 | U22.P1 118.69,41.19 118.49,41 v117.65,41
  Bottom 0.152: v117.2,37.19 117.2,37.8 117.35,37.95 117.35,40.01 117.65,40.39 v117.65,41
  Bottom 0.381: v117.65,41 v117.65,43.2
EN0RXI_N
  Top 0.22: 38.56,40.24 40.7,38.1 40.7,37.01 U1.P$53 | 38.56,40.24 35.62,43.18 35.62,48.38 34.52,49.48 33.07,49.48 U10.P$8 | R21.2 38.61,40.24 38.56,40.24
EN0RXI_P
  Top 0.22: 38.3,39.98 40.33,37.95 40.33,36.82 U1.P$54 | 38.3,39.98 35.25,43.03 35.25,45.93 34.24,46.94 33.07,46.94 U10.P$6 | R22.2 38.3,39.92 38.3,39.98
EN0TXO_N
  Top 0.152: 40.98,35.03 40.21,35.8
  Top 0.22: 40.21,35.8 39.07,35.8 35.79,39.07 | 35.79,39.07 35.11,39.75 35.11,42.16 34.14,43.13 33.07,43.13 U10.P$3 | R23.2 35.82,39.07 35.79,39.07 | U1.P$56 40.98,35.03
EN0TXO_P
  Top 0.152: 40.71,34.77 40.05,35.42
  Top 0.22: 40.05,35.42 38.91,35.42 35.49,38.84 | 35.49,38.84 34.74,39.6 34.74,40.19 34.34,40.59 33.07,40.59 U10.P$1 | R24.2 35.49,38.74 35.49,38.84 | U1.P$57 40.71,34.77
GND  (via drill 0.3)
  Top 0.152: C43.2 56.08,25.15 55.63,25.6 v55.47,25.6 54.46,26.62 U1.P$114 | U4.1 79.1,43.38 U4.9 U4.V_2 78.64,42.42 78.64,43.2 78.64,43.36 77.04,43.36 76.81,43.13 v76.35,43.13 | U2.4 v9.6,23.62 | C48.2 29.25,28.49 29.34,28.42 29.03,28.73 v28.14,28.73 | v28.14,28.73 28.2,28.66 | C47.2 28.14,27.62 v28.14,28.73 | R26.2 v88.62,39.09 | C20.2 C21.2 | R9.1 93.6,54.74 93.57,54.79 94.56,54.79 94.64,54.81 v94.64,54.79 | R33.1 R27.1 28.5,10.08 | 28.5,10.08 R31.1 R30.1 | 28.5,10.08 v28.5,11.35 | 8.9,20.64 v8.91,20.65 7.24,20.65 5.36,22.52 U7.P5 | USR_SW1.P$4 v1.52,12.29 USR_SW1.P$3 | v14.12,28.3 14.12,29.99 RESET.P$2 21.64,30.02 | RESET.P$1 21.48,30.25 21.42,30.25 21.64,30.02 | 21.72,30.02 21.64,30.02 | C3.2 33.3,27.52 33.3,27.05 35.13,27.05 35.59,27.51 v35.59,27.58 35.59,28.42 35.65,28.35 C46.2 | C16.2 40.92,39.24 40.94,39.05 | R25.2 v34.14,35.74 | 103.52,33.91 U20.P$3 104.83,33.92 v105.08,33.68 | 119.23,27.93 C9.2 119.33,27.74 v119.33,27.05 | v118.95,33.68 119.86,33.68 120.17,33.98 R29.1 | U20.P$55 109.96,36.38 v109.96,38.63 109.96,39.47 C12.2 | 110.87,45.34 v110.8,45.41 109.65,45.41 109.41,45.66 R14.2 105.21,45.66 R13.2 R12.2 | U22.P5 118.44,43.79 v117.42,44.81 | U20.P$39 113.75,30.43 v113.16,31.01 | 40.94,39.05 41.11,39.05 v42.06,38.1 42.44,38.1 U1.P$48 | C44.2 38.26,25.15 v39.32,25.15 | C42.2 57.75,38.26 57.15,38.86 55.24,38.86 v55.02,38.63 55.02,38.41 U1.P$17 | C41.2 40.93,39.05 40.94,39.05 | U5.3 92.96,39.85 94,39.85 | U5.V U5.7 | C40.2 40.54,24.92 40.78,24.67 41.67,24.67 v41.68,24.69 42.06,25.07 42.06,25.46 U1.P$80 | C45.2 39.09,21.03 39.18,20.94 39.91,20.94 v39.93,20.95 | USR_SW2.P$4 v11.25,8.38
  Top 0.152: C8.2 123.05,31.56 123.05,32.32 v122.76,32.61 | U20.P$35 v113.39,28.43 v113.39,28.42 113.39,27.93 U20.P$34 116.41,27.93 C11.2 | C2.2 118.11,27.28 v117.35,26.52 | U20.P$32 112.95,24.36 v113.39,23.93 | U20.P$12 102.5,29.43 v102.18,29.11 101.31,29.11 C13.2 | C5.2 111.11,21.95 v112.01,21.95 | WAKE.P$4 v4.95,34.52 7.85,34.52 7.92,34.44 WAKE.P$3 | U6.P9 117.12,17.75 v116.13,18.75 | U6.P5 116.38,20.07 v116.2,20.04 | U1.P$58 41.21,33.68 v41.91,33.68 | U1.P$55 41.38,35.2 42.06,34.52 v42.67,34.52 | U1.P$10 55.02,34.45 v55.02,34.06 | R34.1 121.08,34.14 121.08,33.38 121.01,33.3 v121.01,32.54 | C33.2 121.16,35.14 v121.16,36.04 | C32.2 7.4,19.74 v8.61,19.74 | R52.1 v8.46,18.59 | USR_SW2.P$3 10.06,15.47 9.98,15.54 v9.98,17.45 | C31.2 17.52,54 | C19.2 91.31,39.78 91.67,39.78 91.59,39.74 C19.2
  Top 0.254: C19.2 91.56,39.81 91.44,39.7 91.59,39.85 92.95,39.85 U5.3 | C20.2 93.46,43.32 v93.88,42.9 | 94,39.85 U5.V | 78.64,43.2 U4.V_4 U4.V | U4.V_2 U4.V_6 U4.V_5 U4.V_3 | v39.4,23.62 39.57,23.6 C4.2 | C15.2 60.33,25.63 v60.5,25.6 | C14.2 59.72,24.41 59.74,24.38 59.78,24.42 59.78,24.34 59.82,24.31 v59.82,24.38 | C29.2 v7.09,6.1 | C30.2 2.67,6.17 3.12,6.17 3.5,6.55 v3.5,7.01 | C6.2 v107.21,40.92 | C7.2 107.52,38.7 v107.52,38.33 | U20.P$27 110.45,24.57 v110.87,24.16 111.98,24.16 111.98,23.2 111.94,23.16 C10.2 | U3.4 118.39,36.55 v118.95,37.11
  Top 0.381: C23.2 64.58,54.56 v65.91,54.56 | C24.2 v65.91,52.12 | C26.2 123.14,47.78 122.91,47.55 v122.3,47.55 | C25.2 v119.41,49.84 | C22.2 33.81,52.48 v33.83,52.5 | C18.2 31.84,36.81 v32.08,36.42 | C17.2 36.93,46.43 v36.88,46.1
  Top 0.406: X11.3 119.82,4.64 119.82,5.45 119.79,5.49 C28.2 C27.2
  Top 0.508: 17.52,54 R47.1 33.58,54 v34.14,54.56
  Bottom 0.152: v28.5,11.35 28.5,11.43 | v8.91,20.65 8.84,20.57 | v59.82,24.38 59.74,24.38 | U21.5 113.06,42.06 v111.33,42.06 | U21.9 U21.3 112.47,45.19 111.71,45.19 111.48,45.41 v110.8,45.41 | v113.16,31.01 113.23,30.94 | v105.08,33.68 105,33.76 | v113.39,28.42 113.46,28.42 | v117.35,26.52 117.42,26.59 | v113.39,23.93 113.46,23.93 | v112.01,21.95 111.94,21.95 | v41.91,33.68 41.83,33.68 | v42.67,34.52 | v8.61,19.74 8.53,19.74 | v8.46,18.59 8.38,18.59 | v9.98,17.45 9.98,17.53 | v34.14,54.56 34.06,54.56
  Bottom 0.254: v93.88,42.9 93.95,42.82 | v39.4,23.62 39.47,23.62 | v7.09,6.1 7.01,6.1 | v107.21,40.92 107.14,40.77 | v107.52,38.33 107.52,38.41 | v110.87,24.16 110.72,24.23 | v118.95,37.11 118.87,37.03
  Bottom 0.381: v65.91,54.56 65.84,54.56 | v65.91,52.12 65.84,52.12 | v119.41,49.84 119.48,49.84 | v33.83,52.5 33.76,52.5 | v32.08,36.42 32.16,36.35
  pour Route2: 0,36.2 29.51,36.2 32.26,38.91 32.26,55.88 124.46,55.88 124.46,0 0,0
ICDI_RESET  (via drill 0.3)
  Top 0.152: U20.P$38 115.14,29.95 116.36,29.95 v116.72,30.31 117.05,29.95 117.88,29.95 118.11,29.72 C2.1 | R3.1 116.36,47.02 115.59,47.78 v114.99,47.78
  Bottom 0.152: v116.72,30.31 115.96,30.31 115.15,30.31 114.91,30.56 114.91,37.41 116.43,38.94 116.43,43.97 116.05,44.35 116.05,44.81 115.82,45.03 115.82,46.94 v114.99,47.78 114.3,47.78 113.39,48.69 112.62,48.69 112.17,48.23 112.17,47.32 112.42,47.07 U21.10
ICDI_TCK  (via drill 0.3)
  Top 0.152: U20.P$52 111.45,38.45 112.32,39.32 112.93,39.32 113.08,39.47 113.08,40.54 113.29,40.77 R4.2 113.29,41.89 113.69,42.29 v114.91,42.29
  Bottom 0.152: U21.4 114.5,42.7 v114.91,42.29
ICDI_TDI  (via drill 0.3)
  Top 0.152: U20.P$50 112.45,37.93 v112.93,38.41
  Bottom 0.152: U21.8 111.63,43.97 111.1,43.43 110.72,43.05 110.72,40.23 112.55,38.41 v112.93,38.41
ICDI_TDO  (via drill 0.3)
  Top 0.152: U20.P$49 112.95,37.54 113.29,37.87 v113.84,37.87
  Bottom 0.152: v113.84,37.87 113.84,38.94 113.23,39.47 113.08,39.62 113.08,40.77 U21.6
ICDI_TMS  (via drill 0.3)
  Top 0.152: U20.P$51 111.95,38.42 112.55,39.01 114.22,39.01 v114.61,38.63 | v115.37,44.42 116.2,44.42 116.22,44.41 116.3,44.41 R5.2
  Bottom 0.152: U21.2 113.74,45.19 115.06,45.19 115.37,44.88 v115.37,44.42 115.37,42.82 115.98,42.22 115.98,39.24 115.37,38.63 v114.61,38.63
ICDI_USBD_N
  Top 0.275: U20.P$43 116.38,32.42 116.43,32.48 117.06,32.48 117.87,33.29 117.87,35.65 U3.2 | 117.87,35.68 U3.2 | U22.P2 119.18,41.84 119.18,41.85 117.44,41.85 116.5,40.91 116.5,38.72 116.97,38.25 117.2,38.25 117.88,37.57 U3.2
ICDI_USBD_P
  Top 0.275: U20.P$44 116.41,32.92 116.43,32.9 116.88,32.9 117.44,33.46 117.44,35.49 117.35,35.59 117.37,35.61 U3.1 117.32,35.74 116.81,35.74 116.51,36.04 116.51,38.1 116.07,38.55 116.07,41.08 117.26,42.28 119.18,42.28 119.39,42.49 U22.P3
ICDI_VDDC
  Top 0.254: C6.1 109.04,40.69 109.12,40.69 109.04,40.62 109.04,40.31 108.8,40.07 C7.1 108.81,39.1 108.81,38.41 109.45,37.76 U20.P$56 109.45,35.24 109.19,34.98 108.66,34.98 108.05,34.37 108.05,32.92 109.45,31.52 U20.P$25 109.45,24.11 109.27,23.93 109.27,22.33 109.58,22.02 109.88,22.02 C5.1
JACK_RX_N
  Top 0.22: U14.6 8.47,47.24 9.93,45.78 11.68,45.78 13.21,47.3 15.54,47.3 | 15.54,47.3 20.47,47.3 | 20.47,47.3 22.25,47.3 22.86,47.91 22.86,49.07 23.29,49.51 U10.P$9 | U13.5 15.6,47.35 15.54,47.3 | U13.4 20.52,47.35 20.47,47.3
JACK_RX_P
  Top 0.22: U14.3 8.71,44.18 9.93,45.41 11.84,45.41 13.36,46.93 15.62,46.93 | 15.62,46.93 20.55,46.93 | 20.55,46.93 24.46,46.93 U10.P$11 | U13.6 15.6,46.91 15.62,46.93 | U13.3 20.52,46.91 20.55,46.93
JACK_TX_N
  Top 0.22: U14.2 9.12,43.16 10.72,44.76 15.52,44.76 | 15.52,44.76 20.65,44.76 | 20.65,44.76 21.84,44.76 23.45,43.16 U10.P$14 | U13.2 20.65,45.21 20.65,44.76 | U13.7 15.52,45.21 15.52,44.76
JACK_TX_P
  Top 0.22: U14.1 8.62,42.14 10.87,44.39 15.57,44.39 | 15.57,44.39 20.62,44.39 | 20.62,44.39 21.69,44.39 22.86,43.22 22.86,41.25 23.5,40.62 U10.P$16 | U13.1 20.62,43.94 20.62,44.39 | U13.8 15.57,43.94 15.57,44.39
MCU_3V3  (via drill 0.3)
  Top 0.152: 55.83,24.41 55.32,24.92 v54.86,24.92 54.9,24.95 54.83,24.95 54.86,25.22 54.86,25.68 54.25,26.29 | 31.47,52.47 C22.1 | v38.56,38.71 37.95,38.71 37.49,39.17 R22.1 37.28,39.3 36.8,39.78 36.68,39.8 R23.1 | v35.43,37.26 35.43,37.34 34.9,37.87 R24.1 34.72,37.97 | C16.1 40.69,40.62 40.79,40.62 C41.1 41.83,39.62 v42.52,38.94 | 39.4,41.07 R21.1 39.24,41.07 38.63,41.68 v38.48,41.68 | 42.75,38.79 v42.52,38.94 | 32.92,22.1 R39.2 32.94,22.25 33.6,22.25 34.29,21.57 36.96,21.57 37.03,21.49 v37.57,21.49 | R2.1 55.67,20.27 56.39,20.27 v56.84,20.73 56.39,21.18 R1.1 | v51.97,21.79 U1.P$101 | 41.57,26.02 arc90 v41.53,25.98 | R41.2 61.91,35.97 v63.09,35.97 | v41.53,25.98 42.02,25.98 U1.P$79 | 41.27,25.98 v41.53,25.98 | 55.63,24.46 55.83,24.41 | 55.83,24.41 C43.1 | C42.1 56.6,38.02 v55.7,38.02 55.19,38.02 U1.P$16 | 42.75,38.94 v42.52,38.94 | C40.1 40.62,25.76 40.83,25.97 41.52,25.97 v41.53,25.98 | U1.P$113 54.25,26.29 | 54.33,26.29 54.25,26.29 | 44.5,41.38 v44.5,41.44 44.5,40.92 44.73,40.92 44.88,40.77 44.88,40.75 U1.P$39 | U1.P$28 51.44,41.05 v51.44,41.91 51.97,41.38 51.97,40.46 U1.P$26 | U1.P$8 55.78,34.08 55.78,33.53 | 55.78,33.53 v55.32,33.07 | U1.P$7 55.79,33.53 55.78,33.53 | U1.P$51 41.38,37.47 v41.38,37.49 41.38,36.91 U1.P$52 | U1.P$69 40.69,30.31 v40.69,30.79 | U1.P$90 46.64,24.38 v46.79,24.54 | U1.P$47 42.82,38.28 42.82,38.63 v42.52,38.94
  Top 0.254: U1.P$122 57.75,27.89 v58.14,27.89
  Top 0.381: C22.1 31.55,52.43 31.55,51.51 32.16,50.9 v33.15,50.9 | U10.P$7 33.05,48.31 v34.52,48.31 | U10.P$2 34.16,41.88 v34.44,41.83 | C18.1 32.73,38.3 32.92,38.48 32.92,39.01 32.93,39.15 v32.92,39.17 | R44.1 25.76,36.12 25.77,36.1 25.77,35.52 v25.38,35.13 | C17.1 36.93,49.33 v36.88,49.38
  Bottom 0.152: v63.09,35.97 63.02,35.97 | v55.7,38.02 55.63,37.95 | v44.5,41.44 44.5,41.45 | v40.69,30.79 40.69,30.71 | v46.79,24.54 46.71,24.38 | v56.84,20.73 56.77,20.8
  Bottom 0.381: v33.15,50.9 33.07,50.9 | v34.52,48.31 34.44,48.31 | v34.44,41.83 34.37,41.91 | v32.92,39.17 32.92,39.09 | v25.38,35.13 25.3,35.13 | v36.88,49.38 36.96,49.38
  pour Route15: 38.94,19.05 55.88,19.05 63.5,26.67 63.5,30.48 66.04,30.48 66.04,33.02 63.5,33.02 63.5,36.83 55.88,44.45 40.64,44.45 40.64,46.76 34.9,52.5 34.9,55.17 32.23,55.17 32.23,38.94 29.49,36.2 24.38,36.2 24.38,32.69 28.12,32.69 33.02,32.64 33.02,26.67 37.49,22.25 37.49,20.5
N$1
  Top 0.152: U20.P$40 114.92,30.94 117.96,30.94 119.18,29.72 119.18,28.95 C9.1 119.48,28.81 120.16,28.81 120.32,28.65 120.51,28.43 Y2.P$1
N$2
  Top 0.152: Y2.P$3 122.53,30.4 122.52,30.42 122.52,31.03 122.3,31.24 122,31.32 C8.1 R50.2
N$3
  Top 0.152: D0.C 92.42,54.76 R9.2
N$4
  Top 0.152: R30.2 D4.C
N$5
  Top 0.152: R31.2 D3.C
N$6
  Top 0.152: D1.C R33.2
N$7  (via drill 0.3)
  Top 0.152: U4.3 77.14,42.09 76.43,41.38 v76.43,40.92 | v76.43,38.94 79.64,38.94 R35.2 79.7,38.02 79.93,37.8 83.52,37.8 84.81,39.09 R26.1
  Bottom 0.152: v76.43,40.92 v76.43,38.94
N$8
  Top 0.152: 5.05,21.6 U7.P$4 | U7.P$6 U7.P$2 U7.P$1 U7.P$5 5.49,19.82 C32.1 R52.2
  Bottom 0.152: U7.P$3 2.7,27.82 U7.P$6 | U7.P$4 2.7,19.82 U7.P$5
N$9
  Top 0.152: 91.43,40.77 C19.1 | 92.96,40.46 U5.2
  Top 0.254: 92.96,40.46 92.35,40.46 92.05,40.69 91.73,40.69 C19.1
  Top 0.305: R48.1 91.35,40.78 91.36,40.77 C19.1
N$10  (via drill 0.3)
  Top 0.152: v83.36,43.89 82.98,43.51 82.45,43.51 82.14,43.2 81.53,43.2 81.38,43.36 80.59,43.36 U4.8 | TP8.TP 81.74,39.14 81.69,39.09 81,39.09 R36.1
  Bottom 0.152: TP8.TP 83.36,40.18 83.36,41.15 83.67,41.45 83.67,42.14 83.36,42.44 v83.36,43.89
N$11
  Top 0.152: C3.1 34.21,28.49 34.21,28.5 R38.2 34.39,28.83 34.44,28.88 34.98,28.88 34.98,29.34 37.41,29.34 37.64,29.11 38.92,29.11 U1.P$68
N$12
  Top 0.152: R40.2 118.62,21.29 U6.P3
N$13
  Top 0.305: 91.67,44.07 C20.1 92.05,43.73 92.05,43.59 92.65,42.99 R48.2 92.66,42.76 92.66,41.91 92.96,41.91 U5.1
  Top 0.381: 91.75,44.03 C20.1 91.68,44.04 90.83,44.04 88.7,41.91 JP3.2
N$14
  Top 0.152: D2.C R27.2
N$15  (via drill 0.3)
  Top 0.152: R29.2 120.17,36.84 R28.1 120.17,35.74 120.05,35.62 119.14,35.62 118.95,35.43 v118.95,34.9 | U20.P$46 116.14,33.92 v116.59,34.37
  Bottom 0.152: v116.59,34.37 118.42,34.37 v118.95,34.9
N$16
  Top 0.152: R49.2 41.15,21.87 41.29,22.01 41.75,22.01 42.22,22.48 44.12,22.48 44.42,22.78 44.48,22.78 U1.P$89
N$17
  Top 0.152: R50.1 119.21,31.43 U20.P$41
N$20
  Top 0.152: U22.P9 121.31,45.99 U22.P10 U22.P7 U22.P6 U22.P11 | U22.P11 121.31,38.99 U22.P8 | U22.P11 122.96,38.95 123.08,38.87 C33.1 R34.2
N$29
  Top 0.152: R49.1 39.09,21.95 38.94,22.1 38.98,22.1 C45.1 38.7,22.1 35.43,22.1 35.26,22.28 35.26,22.66 Y1.P$1
N$30
  Top 0.152: C47.1 28.19,26.52 28.32,26.54 28.17,26.54 28.42,26.52 | 28.42,26.52 28.96,26.52 30.1,27.66 30.1,28.96 31.55,30.4 34.59,30.4 35.36,29.64 37.64,29.64 37.87,29.41 38.68,29.41 38.68,29.43 U1.P$67 | 28.42,26.52 28.34,26.52 27.96,26.67 27.02,26.67 Y3.P$2
N$31
  Top 0.152: 36.27,24.43 Y1.P$3 36.85,24.42 37.11,24.16 38.1,24.16 38.22,24.19 C44.1 | C44.1 38.48,24.17 | C44.1 38.25,24.16 38.18,24.08 38.18,23.47 38.75,22.9 39.44,22.9 39.55,22.78 43.89,22.78 44.42,23.32 44.45,23.32 U1.P$88
N$32
  Top 0.254: U10.P$15 25.7,41.88 26.29,41.3 26.29,40.01 26.14,39.85 23.24,39.85 22.4,40.69 R32.2
N$33
  Top 0.152: 29.26,29.72 30.25,29.72 31.24,30.71 34.82,30.71 35.51,30.02 37.8,30.02 38.1,29.72 38.4,29.72 U1.P$66 | 29.26,29.72 26.29,29.72 26.16,29.59 Y3.P$1 | 29.26,29.72 29.26,29.38 C48.1
N$34
  Top 0.254: U10.P$10 25.91,48.23 26.98,47.17 26.98,39.7 26.67,39.4 22.25,39.4 22.1,39.55 21.64,39.55 R43.2
N$36
  Top 0.254: R45.1 16.3,40.54 | 16.3,40.54 R46.1 | R43.1 20.66,40.53 | 20.66,40.53 20.65,40.54 | 20.66,40.53 20.69,40.5 | 20.69,40.5 R32.1 | 20.69,40.5 20.65,40.77 19.74,40.77 19.51,40.54 19.13,40.54 | 19.13,40.54 16.3,40.54 | C1.1 19.08,40.49 19.13,40.54
N$44
  Top 0.152: U14.4 7.12,45.2 U14.5
  Top 0.254: U14.4 7.07,45.2 6.1,46.18 5.94,46.18 4.65,44.88 4.65,41.99 5.94,40.69 11.73,40.69 12.45,41.4 R45.2
N$45
  Top 0.152: U14.7 7.12,49.28 U14.8
  Top 0.254: U14.8 7.14,49.28 6.1,48.23 6.02,48.23 3.89,46.1 3.89,42.06 5.94,40.01 15.38,40.01 R46.2
PA0  (via drill 0.3)
  Top 0.152: v64.92,26.09 64.95,26.06 67.74,26.06 69.65,24.16 71.93,24.16 72.06,24.18 JP4.2 | v63.27,43.38 62.94,43.05 56.39,43.05 55.85,43.59 50.06,43.59 49.53,43.05 49,43.05 47.49,41.55 U1.P$33 | v63.5,1.75 62.94,2.29 48.08,2.29 47.55,2.82 43.89,2.82 43.59,3.12 42.75,3.12 42.44,2.82 v32.84,2.82 32.99,2.67
  Bottom 0.152: v63.27,43.38 63.25,43.51 63.25,42.06 64.39,40.92 64.39,34.75 63.63,33.98 63.63,33.68 62.79,32.84 62.79,31.85 62.48,31.55 62.48,27.58 64.01,26.06 64.92,26.06 v64.92,26.09 64.92,21.95 63.86,20.8 63.86,6.71 63.55,6.4 63.55,1.83 63.48,1.75 v63.5,1.75 | v32.84,2.82 32.84,2.36 X11.74
PA1  (via drill 0.3)
  Top 0.152: 45.49,44.27 v45.95,44.27 44.35,44.27 44.12,44.04 42.9,44.04 42.29,44.65 38.94,44.65 37.95,43.66 v37.19,43.66 | v69.27,42.22 58.75,42.22 58.22,42.75 55.85,42.75 55.32,43.28 50.22,43.28 49.68,42.75 49.45,42.75 48.54,41.83 48.54,40.92 48.53,40.92 48.23,40.62 47.85,40.62 47.24,41.22 U1.P$34 46.33,42.14 v46.02,42.14
  Bottom 0.152: v46.02,42.14 46.02,42.6 45.95,42.67 v45.95,44.27 | v37.19,43.66 37.19,43.13 36.88,42.82 36.88,40.23 36.12,39.47 36.12,36.96 35.43,36.27 35.43,33.68 34.98,33.22 33.3,33.22 32.16,32.08 32.16,30.56 31.01,29.41 31.01,27.2 29.03,25.22 29.03,14.86 30.02,13.87 30.02,4.8 30.33,4.5 30.33,2.39 X11.76 | JP5.2 71.88,31.75 69.95,33.68 69.95,41.53 v69.27,42.22
PA2  (via drill 0.3)
  Top 0.152: 44,13.56 R20.2 44.04,13.6 44.04,14.02 44.35,14.33 47.47,14.33 47.62,14.48 v49.61,14.48 50.06,14.48 50.29,14.25 52.2,14.25 53.03,13.41 65.68,13.41 66.29,14.02 68.96,14.02 69.65,13.34 v70.56,13.34 | v117.81,6.78 114.38,6.78 114,6.4 113.23,6.4 113.16,6.33 108.89,6.33 108.58,6.02 106.53,6.02 106.22,5.71 97.16,5.71 96.85,6.02 v96.32,6.02 | v96.01,2.59 v71.02,2.59 | U1.P$35 48.31,39.59 v48.31,39.55
  Bottom 0.152: v48.31,39.55 48.31,39.09 48.16,38.94 48.16,34.59 48.92,33.83 48.92,31.47 49.99,30.4 49.99,29.79 49.23,29.03 49.23,25.45 49.91,24.77 49.91,23.55 49.68,23.32 49.68,14.48 v49.61,14.48 | 118.11,1.29 119.18,2.36 119.18,4.42 118.8,4.8 118.8,5.33 117.81,6.33 v117.81,6.78 | v96.32,6.02 96.32,2.9 v96.01,2.59 | v70.56,13.34 70.56,12.88 70.18,12.5 70.18,4.95 71.02,4.12 v71.02,2.59
  Bottom 0.254: 118.11,1.29 X11.6
PA3  (via drill 0.3)
  Top 0.152: v115.14,5.87 115.06,5.79 113.77,5.79 113.69,5.71 109.35,5.71 109.04,5.41 106.98,5.41 106.68,5.11 94.64,5.11 94.49,5.26 93.57,5.26 93.12,4.8 71.86,4.8 71.4,4.34 70.87,4.34 70.18,5.03 69.49,5.03 69.27,4.8 v68.81,4.8 | v68.73,13.26 68.05,13.26 67.82,13.49 66.6,13.49 66.22,13.11 52.88,13.11 52.05,13.95 50.37,13.95 49.61,13.18 v49.23,13.18 48.84,13.56 48.16,13.56 48.12,13.53 48.19,13.38 R19.2 | v46.94,38.63 46.94,39.17 47.32,39.55 47.32,40.01 U1.P$36
  Bottom 0.152: X11.8 115.57,2.31 114.53,3.35 114.53,4.19 115.14,4.8 v115.14,5.87 | v68.81,4.8 68.73,4.88 v68.73,13.26 | v46.94,38.63 46.94,38.1 47.24,37.8 47.24,33.91 48.01,33.15 48.01,28.19 47.4,27.58 47.4,26.36 48.31,25.45 48.31,22.94 49.07,22.17 49.07,16.38 48.31,15.62 48.31,14.1 v49.23,13.18
PA4  (via drill 0.3)
  Top 0.152: v110.11,47.09 109.65,46.63 107.9,46.63 107.59,46.94 90.3,46.94 88.16,44.81 76.96,44.81 75.59,46.18 70.56,46.18 68.66,44.27 62.71,44.27 62.1,43.66 56.84,43.66 56.31,44.2 49.76,44.2 49.23,43.66 46.94,43.66 46.63,43.36 45.41,43.36 | 45.41,43.36 42.06,43.36 41.76,43.66 41.22,43.66 41.17,43.61 v41.22,43.61 | U1.P$37 46.1,40.69 45.41,41.38 45.41,43.36
  Bottom 0.152: v41.22,43.61 41.22,43.66 40.16,44.73 40.16,51.28 X6.18 | X11.10 113.03,2.16 114.22,3.35 114.22,4.12 113.69,4.65 113.69,6.25 114.07,6.63 114.07,35.81 109.73,40.16 109.73,41.83 109.42,42.14 109.42,46.41 109.5,46.48 v110.11,47.09
PA5  (via drill 0.3)
  Top 0.152: v109.04,47.24 90.14,47.24 88.01,45.11 77.19,45.11 75.82,46.48 70.33,46.48 68.43,44.58 62.41,44.58 61.8,43.97 57.15,43.97 56.62,44.5 49.61,44.5 49.07,43.97 46.63,43.97 46.33,43.66 42.52,43.66 41.99,44.2 40.69,44.2 40.46,43.97 | 40.46,43.97 39.7,43.97 v39.29,43.99 | 40.46,43.97 40.46,43.43 40.92,42.98 44.65,42.98 45.11,42.52 45.11,41.07 45.13,41.07 U1.P$38
  Bottom 0.152: X6.20 36.85,52.05 36.85,51.23 39.32,48.77 39.32,44.5 v39.29,43.99 | X11.12 109.5,2.26 109.5,12.95 110.41,13.87 110.41,22.02 109.35,23.09 109.35,24.23 111.1,25.98 111.1,36.35 109.12,38.33 109.12,46.56 109.04,46.63 v109.04,47.24
PA6  (via drill 0.3)
  Top 0.152: X8.16 104.17,50.83 102.41,50.83 101.65,50.06 98.68,50.06 98.37,50.37 v93.88,50.37 93.57,50.06 90.6,50.06 86.87,46.33 78.11,46.33 76.73,47.7 68.73,47.7 67.13,46.1 58.9,46.1 58.37,45.57 55.78,45.57 55.55,45.8 v44.5,45.8 | v44.12,42.37 43.81,42.06 43.81,40.92 44.12,40.62 44.45,40.62 U1.P$40
  Bottom 0.152: v93.88,50.37 92.73,49.23 92.73,25.91 90.98,24.16 90.98,19.58 94.64,15.93 94.64,14.4 93.04,12.8 93.04,5.71 92.73,5.41 92.73,3.83 X11.25 | v44.12,42.37 44.5,42.75 v44.5,45.8
PA7  (via drill 0.3)
  Top 0.152: v90.14,8.15 89.76,8.53 76.89,8.53 76.58,8.23 72.54,8.23 72.24,8.53 v67.59,8.53 66.98,8.53 66.9,8.46 62.56,8.46 62.03,7.85 54.18,7.85 53.14,8.89 X7.8 | v43.2,41 43.97,40.23 44.27,40.23 U1.P$41 | v43.43,45.49 43.74,45.19 44.96,45.19 45.26,45.49 48.84,45.49 49.15,45.19 58.75,45.19 58.98,45.49 v65.46,45.49
  Bottom 0.152: X11.27 90.14,3.83 v90.14,8.15 | v43.2,41 43.2,42.52 43.51,42.82 43.51,44.5 43.43,44.58 v43.43,45.49 | v65.46,45.49 65.46,36.5 68.66,33.3 68.66,28.19 67.97,27.51 67.97,15.24 67.74,15.01 67.74,12.88 67.89,12.72 67.89,12.34 67.74,12.19 67.74,9.14 67.59,8.99 v67.59,8.53
PB0  (via drill 0.3)
  Top 0.152: v54.79,6.02 54.48,5.79 48.31,5.79 48.23,5.71 42.67,5.71 42.6,5.79 v41.3,5.79 41.22,5.87 | R18.1 18.94,22.63 26.36,22.63 30.79,18.21 36.04,18.21 37.26,19.43 41.76,19.43 v42.06,19.74 43.43,21.11 46.18,21.11 47.19,22.12 U1.P$95
  Bottom 0.152: X11.58 52.07,2.16 53.42,3.5 53.42,4.19 54.79,5.56 v54.79,6.02 | v41.3,5.79 39.93,7.16 39.93,7.92 40.46,8.46 40.46,11.51 41.53,12.57 41.53,13.49 41.15,13.87 41.15,16.08 42.06,16.99 v42.06,19.74
PB2  (via drill 0.3)
  Top 0.152: X8.17 102.62,54.61 101.58,53.57 92.2,53.57 v91.44,52.81 | v91.44,51.51 90.22,51.51 85.95,47.24 78.79,47.24 76.5,49.53 67.97,49.53 66.14,47.7 55.24,47.7 54.79,47.32 v47.55,47.32 v38.56,47.32 | v48.31,26.75 48.31,25.07 47.17,23.93 46.79,23.93 46.25,23.39 46.22,23.39 U1.P$91 | v38.71,5.49 v36.2,5.49
  Bottom 0.152: v91.44,52.81 v91.44,51.51 | v47.55,47.32 47.55,44.2 48.46,43.28 48.46,41.15 47.55,40.23 47.55,39.4 47.85,39.09 47.85,34.37 48.62,33.6 48.62,27.81 48.31,27.51 v48.31,26.75 | X11.67 39.37,4.85 v38.71,5.49 | v36.2,5.49 35.2,6.48 35.2,7.7 35.51,8 35.51,10.82 35.81,11.12 35.81,26.82 36.35,27.36 36.35,27.81 35.36,28.8 35.36,31.17 36.2,32 36.2,36.04 36.73,36.58 36.73,39.09 37.49,39.85 37.49,42.14 38.1,42.75 38.1,44.88 37.87,45.11 37.87,46.63 v38.56,47.32
PB3  (via drill 0.3)
  Top 0.152: X8.19 95.45,54.61 94.79,53.95 91.67,53.95 85.57,47.85 79.32,47.85 77.04,50.14 67.36,50.14 65.53,48.31 54.63,48.31 54.56,48.23 47.09,48.23 46.79,48.54 v46.33,48.54 46.02,48.23 43.97,48.23 43.59,48.62 v38.48,48.62 | v49,24 48.54,24 48.16,23.62 47.01,23.62 U1.P$92
  Bottom 0.152: v46.33,48.54 46.33,44.88 48.08,43.13 48.08,41.38 47.24,40.54 47.24,39.24 47.55,38.94 47.55,34.14 48.31,33.38 48.31,28.04 47.7,27.43 47.7,26.52 48.62,25.6 48.62,25.07 49,24.69 v49,24 | X11.69 36.83,3.86 35.36,5.33 35.05,5.33 34.44,5.94 34.44,7.47 35.13,8.15 35.13,11.2 35.43,11.51 35.43,26.21 34.9,26.75 34.9,31.39 35.81,32.31 35.81,36.2 36.42,36.8 36.42,39.24 37.19,40.01 37.19,42.44 37.8,43.05 37.8,44.65 37.57,44.88 37.57,47.7 v38.48,48.62
PB4  (via drill 0.3)
  Top 0.152: v94.03,12.65 v78.56,12.65 | v94.03,4.65 94.56,4.65 94.72,4.8 106.91,4.8 107.21,5.11 109.19,5.11 109.5,5.41 113.92,5.41 114,5.49 114.68,5.49 114.91,5.26 117.65,5.26 v117.81,5.41 | v78.56,26.75 76.5,26.75 75.29,27.96 71.25,27.96 70.56,27.28 57.84,27.28 57.07,28.04 57.03,28.04 U1.P$121 55.85,29.21 55.85,29.87 56.24,30.25 v56.24,30.94
  Bottom 0.152: v78.56,12.65 78.56,17.6 78.87,17.91 78.87,20.04 78.56,20.34 v78.56,26.75 | v94.03,12.65 v94.03,4.65 | v117.81,5.41 117.81,4.95 118.11,4.65 X11.5 | X6.6 54.61,50.88 53.87,50.14 53.87,44.27 54.41,43.74 54.41,33.07 56.24,31.24 v56.24,30.94
PB5  (via drill 0.3)
  Top 0.152: v116.05,5.87 116.05,6.48 114.83,6.48 114.45,6.1 113.46,6.1 113.39,6.02 109.12,6.02 108.81,5.71 106.76,5.71 106.45,5.41 94.87,5.41 94.72,5.56 93.34,5.56 93.19,5.41 86.87,5.41 86.56,5.11 71.25,5.11 v71.09,5.03 | v69.57,26.67 68.5,26.67 68.2,26.98 57.68,26.98 56.92,27.74 56.77,27.74 U1.P$120 55.47,29.03 55.47,30.1 v54.71,30.86
  Bottom 0.152: X11.7 115.57,5.38 v116.05,5.87 | v71.09,5.03 71.09,8.38 71.48,8.76 71.48,20.88 70.56,21.79 70.56,23.62 71.09,24.16 71.09,25.15 v69.57,26.67 | X6.8 52.07,51.03 52.88,50.22 52.88,43.74 53.49,43.13 53.49,32.16 v54.71,30.86
PC4  (via drill 0.3)
  Top 0.152: v98.22,48.54 100.51,48.54 100.81,48.84 101.88,48.84 102.18,48.54 109.88,48.54 111.18,49.84 v117.96,49.84 | v95.33,37.57 94.87,37.57 94.72,37.72 85.04,37.72 84.2,36.88 78.33,36.88 77.5,37.72 71.09,37.72 67.51,41.3 57.99,41.3 57.91,41.38 52.73,41.38 52.27,40.92 52.27,40.2 U1.P$25
  Bottom 0.152: v98.22,48.54 98.3,40.84 98.3,39.55 96.32,37.57 v95.33,37.57 95.33,31.24 96.62,29.95 96.62,28.42 96.39,28.19 96.39,26.98 96.55,26.82 99.44,23.85 99.44,19.13 95.33,15.01 95.33,3.89 X11.23 | v117.96,49.84 117.96,50.37 119.18,51.59 119.18,53.54 X8.5
PC5  (via drill 0.3)
  Top 0.152: v99.06,47.93 100.43,47.93 101.04,48.54 101.65,48.54 101.96,48.23 110.41,48.23 110.72,48.54 111.33,49.23 v116.74,49.23 | v97.54,37.26 97.08,37.26 96.77,36.96 95.02,36.96 94.56,37.41 85.27,37.41 84.43,36.58 78.11,36.58 77.27,37.41 70.87,37.41 67.28,41 57.76,41 57.68,41.07 52.88,41.07 52.58,40.77 52.58,39.94 U1.P$24